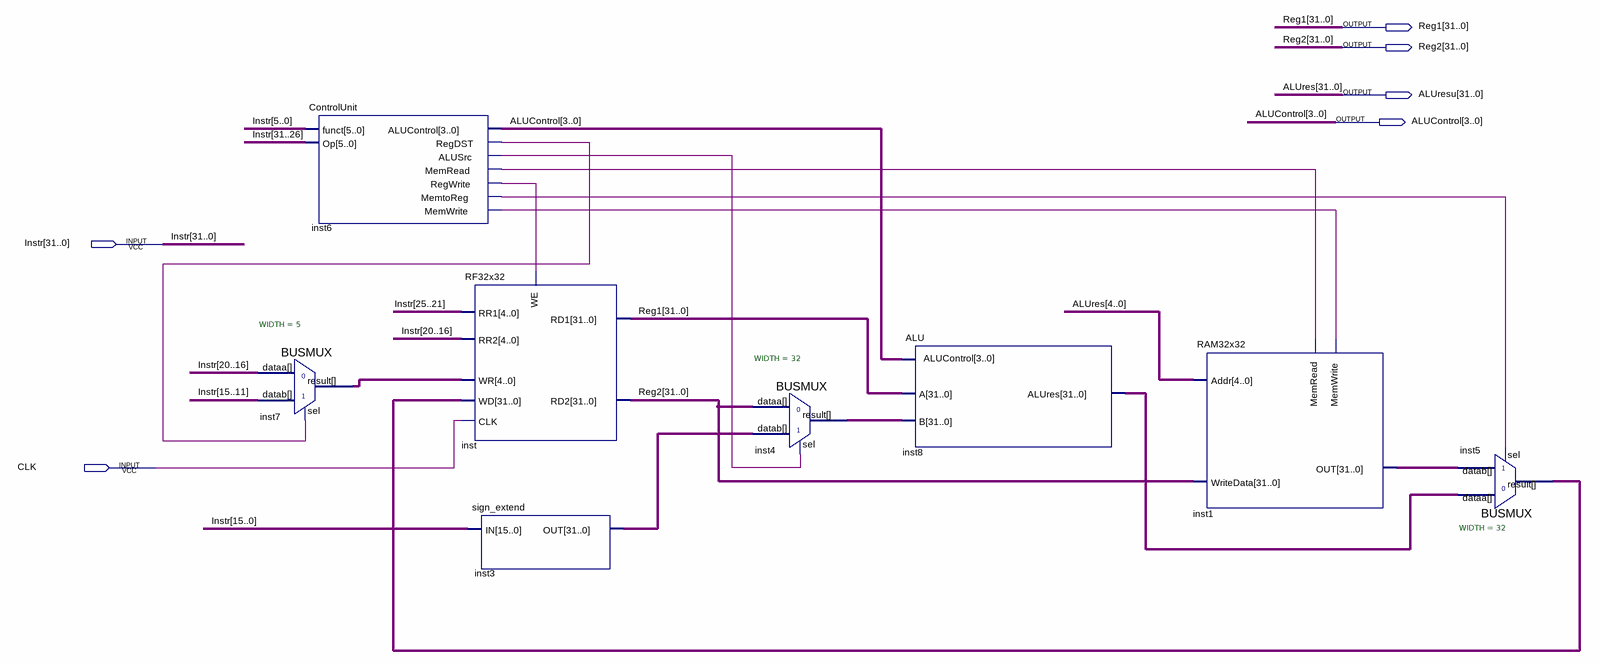
[diagram p0: schematic sheet]
// Quartus schematic Top_final.bdf as structural Verilog: 8 symbols, 6 pins
module Top_final (
  input  [31:0] Instr,
  input  CLK,
  output [31:0] Reg1,
  output [31:0] Reg2,
  output [31:0] ALUresu,
  output [3:0] ALUControl
);

  wire inst6_alusrc, inst6_memread, inst6_memtoreg, inst6_memwrite, inst6_regdst, inst6_regwrite;
  wire [4:0] inst7_result;
  wire [31:0] inst1_out, inst3_out, inst4_result, inst5_result;

  BUSMUX #(.WIDTH(5)) inst7 (.datab(Instr[15:11]), .sel(inst6_regdst), .dataa(Instr[20:16]), .result(inst7_result));
  ControlUnit inst6 (
    .funct(Instr[5:0]), .Op(Instr[31:26]), .ALUControl(ALUControl), .RegDST(inst6_regdst),
    .ALUSrc(inst6_alusrc), .MemRead(inst6_memread), .RegWrite(inst6_regwrite), .MemtoReg(inst6_memtoreg),
    .MemWrite(inst6_memwrite));
  RF32x32 inst (
    .WD(inst5_result), .WR(inst7_result), .WE(inst6_regwrite), .RR1(Instr[25:21]), .RR2(Instr[20:16]),
    .CLK(CLK), .RD1(Reg1), .RD2(Reg2));
  sign_extend inst3 (.IN(Instr[15:0]), .OUT(inst3_out));
  BUSMUX #(.WIDTH(32)) inst4 (.datab(inst3_out), .sel(inst6_alusrc), .dataa(Reg2), .result(inst4_result));
  ALU inst8 (.A(Reg1), .B(inst4_result), .ALUControl(ALUControl), .ALUres(ALUresu));
  RAM32x32 inst1 (
    .Addr(ALUresu[4:0]), .WriteData(Reg2), .MemWrite(inst6_memwrite), .MemRead(inst6_memread), .OUT(inst1_out));
  BUSMUX #(.WIDTH(32)) inst5 (.datab(inst1_out), .sel(inst6_memtoreg), .dataa(ALUresu), .result(inst5_result));

  // Other names for the same wires on the sheet: ALUres[31:0] = ALUresu
endmodule
